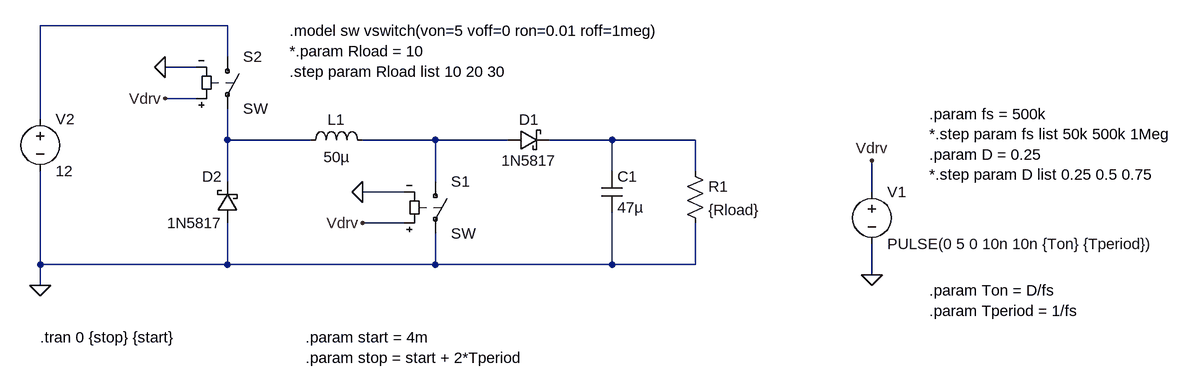
[diagram p0: schematic buck-boost.asc]
buck-boost.asc, the LTspice schematic file:
Version 4
SHEET 1 1804 780
WIRE -1088 80 -1376 80
WIRE -1088 128 -1088 80
WIRE -1136 144 -1184 144
WIRE -1136 192 -1184 192
WIRE -1376 224 -1376 80
WIRE -1088 256 -1088 208
WIRE -960 256 -1088 256
WIRE -768 256 -880 256
WIRE -656 256 -768 256
WIRE -496 256 -592 256
WIRE -368 256 -496 256
WIRE -496 304 -496 256
WIRE -368 304 -368 256
WIRE -1088 320 -1088 256
WIRE -768 320 -768 256
WIRE -816 336 -880 336
WIRE -96 336 -96 288
WIRE -816 384 -880 384
WIRE -1376 448 -1376 304
WIRE -1088 448 -1088 384
WIRE -1088 448 -1376 448
WIRE -768 448 -768 400
WIRE -768 448 -1088 448
WIRE -496 448 -496 368
WIRE -496 448 -768 448
WIRE -368 448 -368 384
WIRE -368 448 -496 448
WIRE -96 464 -96 416
WIRE -1376 480 -1376 448
FLAG -1376 480 0
FLAG -96 464 0
FLAG -1184 192 Vdrv
FLAG -1184 144 0
FLAG -880 336 0
FLAG -880 384 Vdrv
FLAG -96 288 Vdrv
SYMBOL schottky -656 272 R270
WINDOW 0 32 32 VTop 0
WINDOW 3 0 32 VBottom 0
SYMATTR InstName D1
SYMATTR Value 1N5817
SYMATTR Description Diode
SYMATTR Type diode
SYMBOL schottky -1072 384 R180
WINDOW 0 24 72 Left 0
WINDOW 3 24 0 Left 0
SYMATTR InstName D2
SYMATTR Value 1N5817
SYMATTR Description Diode
SYMATTR Type diode
SYMBOL sw -768 304 R0
SYMATTR InstName S1
SYMBOL ind -976 272 R270
WINDOW 0 32 56 VTop 0
WINDOW 3 5 56 VBottom 0
SYMATTR InstName L1
SYMATTR Value 50µ
SYMBOL cap -512 304 R0
SYMATTR InstName C1
SYMATTR Value 47µ
SYMBOL res -384 288 R0
SYMATTR InstName R1
SYMATTR Value {Rload}
SYMBOL voltage -96 320 R0
WINDOW 123 0 0 Left 0
WINDOW 39 0 0 Left 0
SYMATTR InstName V1
SYMATTR Value PULSE(0 5 0 10n 10n {Ton} {Tperiod})
SYMBOL voltage -1376 208 R0
WINDOW 123 0 0 Left 0
WINDOW 39 0 0 Left 0
SYMATTR InstName V2
SYMATTR Value 12
SYMBOL sw -1088 112 R0
SYMATTR InstName S2
TEXT -992 88 Left 0 !.model sw vswitch(von=5 voff=0 ron=0.01 roff=1meg)\n*.param Rload = 10\n.step param Rload list 10 20 30
TEXT -1376 560 Left 0 !.tran 0 {stop} {start}
TEXT -8 216 Left 0 !.param fs = 500k\n*.step param fs list 50k 500k 1Meg\n.param D = 0.25\n*.step param D list 0.25 0.5 0.75
TEXT -968 560 Left 0 !.param start = 4m\n.param stop = start + 2*Tperiod
TEXT -8 488 Left 0 !.param Ton = D/fs\n.param Tperiod = 1/fs

The netlist it stands for:
* buck-boost.asc
D1 N003 N004 1N5817
D2 0 N002 1N5817
S1 N003 0 Vdrv 0 SW
L1 N002 N003 50µ
C1 N004 0 47µ
R1 N004 0 {Rload}
V1 Vdrv 0 PULSE(0 5 0 10n 10n {Ton} {Tperiod})
V2 N001 0 12
S2 N001 N002 Vdrv 0 SW
.model D D
.lib standard.dio
.model sw vswitch(von=5 voff=0 ron=0.01 roff=1meg)
*.param Rload = 10
.step param Rload list 10 20 30
.tran 0 {stop} {start}
.param fs = 500k
*.step param fs list 50k 500k 1Meg
.param D = 0.25
*.step param D list 0.25 0.5 0.75
.param start = 4m
.param stop = start + 2*Tperiod
.param Ton = D/fs
.param Tperiod = 1/fs
.backanno
.end